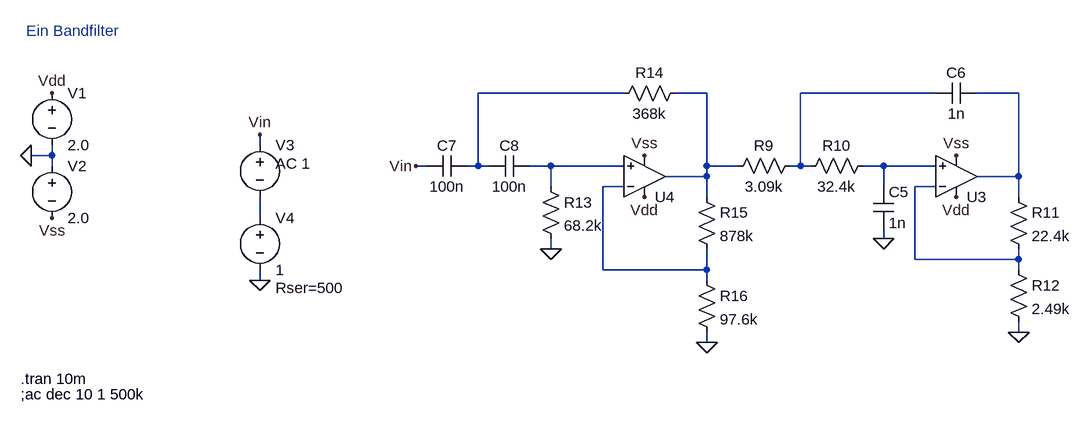
[diagram p0: schematic filter_band.asc]
filter_band.asc, the LTspice schematic file:
Version 4
SHEET 1 1032 1012
WIRE 336 0 112 0
WIRE 464 0 416 0
WIRE 816 0 608 0
WIRE 944 0 880 0
WIRE -224 80 -224 64
WIRE -544 96 -544 80
WIRE -544 96 -576 96
WIRE -544 112 -544 96
WIRE 32 112 16 112
WIRE 112 112 112 0
WIRE 112 112 96 112
WIRE 128 112 112 112
WIRE 224 112 192 112
WIRE 336 112 224 112
WIRE 464 112 464 0
WIRE 512 112 464 112
WIRE 608 112 608 0
WIRE 608 112 592 112
WIRE 624 112 608 112
WIRE 736 112 704 112
WIRE 816 112 736 112
WIRE 464 128 464 112
WIRE 464 128 400 128
WIRE 944 128 944 0
WIRE 944 128 880 128
WIRE 224 144 224 112
WIRE 336 144 304 144
WIRE 736 144 736 112
WIRE 816 144 784 144
WIRE 464 160 464 128
WIRE 944 160 944 128
WIRE -224 192 -224 160
WIRE 736 224 736 208
WIRE 224 240 224 224
WIRE 784 256 784 144
WIRE 944 256 944 240
WIRE 944 256 784 256
WIRE 304 272 304 144
WIRE 464 272 464 240
WIRE 464 272 304 272
WIRE 944 272 944 256
WIRE -224 288 -224 272
WIRE 464 288 464 272
WIRE 944 368 944 352
WIRE 464 384 464 368
FLAG -544 0 Vdd
FLAG -576 96 0
FLAG -544 192 Vss
FLAG -224 288 0
FLAG -224 64 Vin
FLAG 848 160 Vdd
FLAG 848 96 Vss
FLAG 736 224 0
FLAG 944 368 0
FLAG 368 160 Vdd
FLAG 368 96 Vss
FLAG 224 240 0
FLAG 464 384 0
FLAG 16 112 Vin
SYMBOL voltage -544 -16 R0
WINDOW 123 0 0 Left 0
WINDOW 39 0 0 Left 0
SYMATTR InstName V1
SYMATTR Value 2.0
SYMBOL voltage -544 96 R0
WINDOW 123 0 0 Left 0
WINDOW 39 0 0 Left 0
SYMATTR InstName V2
SYMATTR Value 2.0
SYMBOL voltage -224 64 R0
WINDOW 3 24 96 Invisible 2
WINDOW 123 24 44 Left 2
WINDOW 39 0 0 Left 0
SYMATTR Value SINE(0 0 1k)
SYMATTR Value2 AC 1
SYMATTR InstName V3
SYMBOL voltage -224 176 R0
WINDOW 123 0 0 Left 0
WINDOW 39 24 124 Left 2
SYMATTR SpiceLine Rser=500
SYMATTR InstName V4
SYMATTR Value 1
SYMBOL OpAmps\\UniversalOpAmp 848 128 M180
SYMATTR InstName U3
SYMBOL res 608 96 R90
WINDOW 0 0 56 VBottom 2
WINDOW 3 32 56 VTop 2
SYMATTR InstName R9
SYMATTR Value 3.09k
SYMBOL res 720 96 R90
WINDOW 0 0 56 VBottom 2
WINDOW 3 32 56 VTop 2
SYMATTR InstName R10
SYMATTR Value 32.4k
SYMBOL res 928 144 R0
SYMATTR InstName R11
SYMATTR Value 22.4k
SYMBOL res 928 256 R0
SYMATTR InstName R12
SYMATTR Value 2.49k
SYMBOL cap 720 144 R0
SYMATTR InstName C5
SYMATTR Value 1n
SYMBOL cap 880 -16 R90
WINDOW 0 0 32 VBottom 2
WINDOW 3 32 32 VTop 2
SYMATTR InstName C6
SYMATTR Value 1n
SYMBOL OpAmps\\UniversalOpAmp 368 128 M180
SYMATTR InstName U4
SYMBOL cap 96 96 R90
WINDOW 0 0 32 VBottom 2
WINDOW 3 32 32 VTop 2
SYMATTR InstName C7
SYMATTR Value 100n
SYMBOL cap 192 96 R90
WINDOW 0 0 32 VBottom 2
WINDOW 3 32 32 VTop 2
SYMATTR InstName C8
SYMATTR Value 100n
SYMBOL res 208 128 R0
SYMATTR InstName R13
SYMATTR Value 68.2k
SYMBOL res 432 -16 R90
WINDOW 0 0 56 VBottom 2
WINDOW 3 32 56 VTop 2
SYMATTR InstName R14
SYMATTR Value 368k
SYMBOL res 448 144 R0
SYMATTR InstName R15
SYMATTR Value 878k
SYMBOL res 448 272 R0
SYMATTR InstName R16
SYMATTR Value 97.6k
TEXT -592 440 Left 2 !.tran 10m
TEXT -592 464 Left 2 !;ac dec 10 1 500k
TEXT -584 -96 Left 2 ;Ein Bandfilter

The netlist it stands for:
* filter_band.asc
V1 Vdd 0 2.0
V2 0 Vss 2.0
V3 Vin N009 SINE(0 0 1k) AC 1
V4 N009 0 1 Rser=500
XU3 N006 N008 Vdd Vss N004 level1 Avol=1Meg GBW=10Meg Vos=0 En=0 Enk=0 In=0 Ink=0 Rin=500Meg  ; pins In+ In- V+ V- OUT
R9 N003 N002 3.09k
R10 N006 N003 32.4k
R11 N004 N008 22.4k
R12 N008 0 2.49k
C5 N006 0 1n
C6 N004 N003 1n
XU4 N005 N007 Vdd Vss N002 level1 Avol=1Meg GBW=10Meg Vos=0 En=0 Enk=0 In=0 Ink=0 Rin=500Meg  ; pins In+ In- V+ V- OUT
C7 N001 Vin 100n
C8 N005 N001 100n
R13 N005 0 68.2k
R14 N002 N001 368k
R15 N002 N007 878k
R16 N007 0 97.6k
.tran 10m
;ac dec 10 1 500k
* Ein Bandfilter
.lib UniversalOpAmp1.lib
.backanno
.end